# EAGLE design brmeegpwr (EAGLE 6.1)
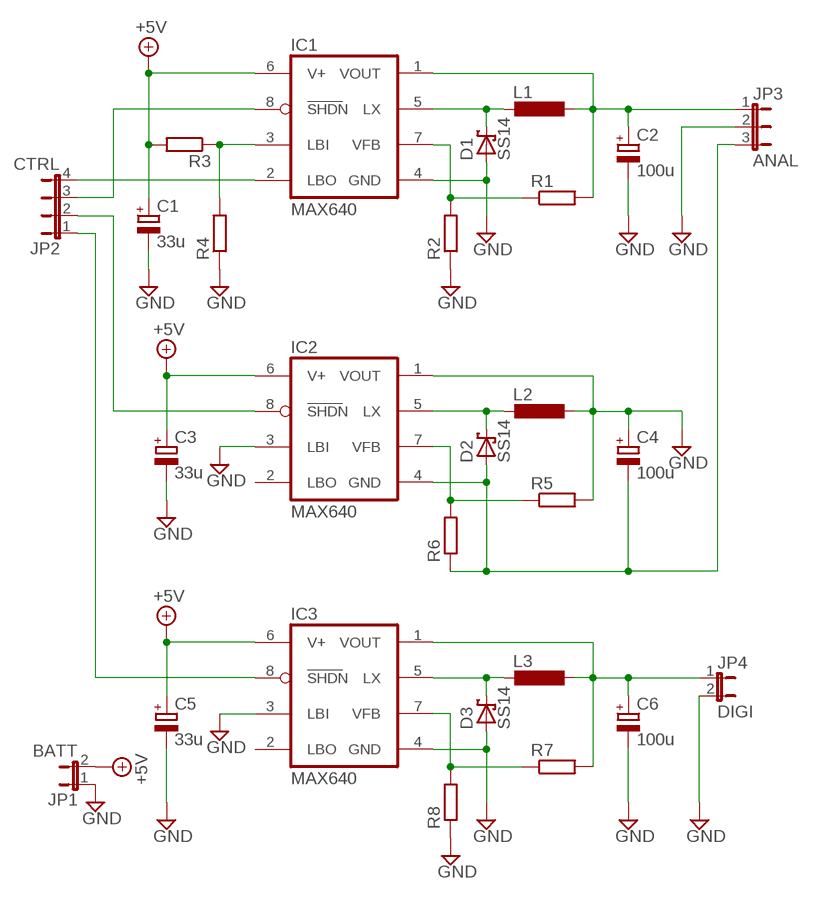
[diagram p0: schematic, sheet 1]

## Parts
C1  33u  CPOL-EUSMCC  [SMC_C]
C2  100u  CPOL-EUSMCC  [SMC_C]
C3  33u  CPOL-EUSMCC  [SMC_C]
C4  100u  CPOL-EUSMCC  [SMC_C]
C5  33u  CPOL-EUSMCC  [SMC_C]
C6  100u  CPOL-EUSMCC  [SMC_C]
D1  SS14  [SMA]
D2  SS14  [SMA]
D3  SS14  [SMA]
IC1  MAX640  [SO08]
IC2  MAX640  [SO08]
IC3  MAX640  [SO08]
JP1  BATT  JP1E  [JP1]
JP2  CTRL  JP4E  [JP4]
JP3  ANAL  JP2E  [JP2]
JP4  DIGI  JP1E  [JP1]
L1  L-EUL1812  [L1812]
L2  L-EUL1812  [L1812]
L3  L-EUL1812  [L1812]
R1  R-EU_R1206  [R1206]
R2  R-EU_R1206  [R1206]
R3  R-EU_R1206  [R1206]
R4  R-EU_R1206  [R1206]
R5  R-EU_R1206  [R1206]
R6  R-EU_R1206  [R1206]
R7  R-EU_R1206  [R1206]
R8  R-EU_R1206  [R1206]

## Nets
3V3: C6.+ IC3.1(VOUT) JP4.1 L3.1 R7.2
+2V5: C2.+ IC1.1(VOUT) JP3.1 L1.1 R1.2
+5V: C1.+ C3.+ C5.+ IC1.6(V+) IC2.6(V+) IC3.6(V+) JP1.2 R3.2
-2V5: C4.- D2.A IC2.4(GND) JP3.3 R6.1
GND: C1.- C2.- C3.- C4.+ C5.- C6.- D1.A D3.A IC1.4(GND) IC2.1(VOUT) IC2.3(LBI) IC3.3(LBI) IC3.4(GND) JP1.1 JP3.2 JP4.2 L2.1 R2.1 R4.1 R5.2 R8.1
N$1: D1.C IC1.5(LX) L1.2
N$2: IC1.8(SHDN) JP2.3
N$3: IC1.2(LBO) JP2.4
N$4: D2.C IC2.5(LX) L2.2
N$6: IC1.3(LBI) R3.1 R4.2
N$8: IC1.7(VFB) R1.1 R2.2
N$9: D3.C IC3.5(LX) L3.2
N$10: IC2.7(VFB) R5.1 R6.2
N$11: IC2.8(SHDN) JP2.2
N$13: IC3.7(VFB) R7.1 R8.2
N$14: IC3.8(SHDN) JP2.1
Unconnected: IC2.2(LBO) IC3.2(LBO)

## Library data of the parts
C1-C6 = rcl:CPOL-EU: POLARIZED CAPACITOR, European symbol
D1-D3 = mindspy:SS14
IC1-IC3 = mindspy:MAX640
JP1 JP4 = jumper:JP1E: JUMPER
JP2 = jumper:JP4E: JUMPER
JP3 = jumper:JP2E: JUMPER
L1-L3 = rcl:L-EU: INDUCTOR, European symbol
R1-R8 = rcl:R-EU_: RESISTOR, European symbol

## Board
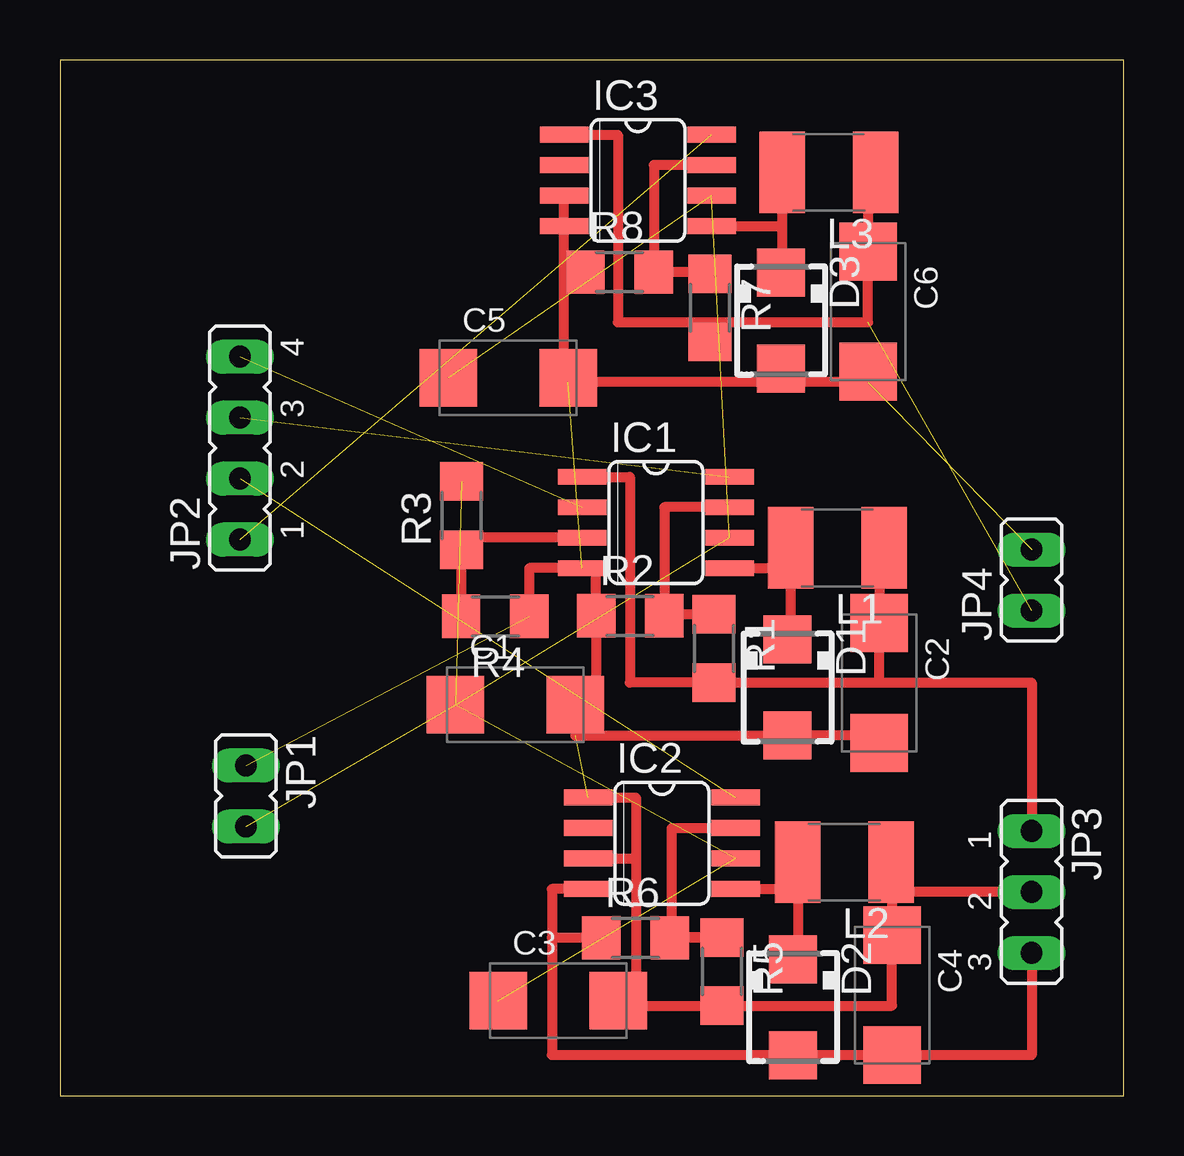
[diagram p1: board, top side]

Size 44.35 x 43.18 mm. Coordinates in mm from the lower left corner, seen from the top.
Outline: 0,0 44.35,0 44.35,43.18 0,43.18 0,0
Copper layers (1*16): Top 0.035mm / dielectric 1.5mm / Bottom 0.035mm
Design rules: minimum track width 10mil, minimum drill 24mil, track to track 8mil, track to pad 8mil, pad to pad 8mil, via to via 8mil, smd to smd 8mil, copper to edge 40mil, drill to drill 8mil, minimum pad ring 10mil, minimum via ring 8mil, stop-mask expansion 4mil, vias tented up to drill 0mil, thermal gap 10mil

### Footprints (pad centres in the part's own frame; a part is rotated, then mirrored left to right if it is on the bottom)
SMC_C = smd 2.4 x 2.4: + -2.5,0; - 2.5,0
SMA = smd 2 x 2: A 2,0; C -2,0
SO08 = smd 0.66 x 2.032: 1 -1.905,-3.073; 2 -0.635,-3.073; 3 0.635,-3.073; 4 1.905,-3.073; 5 1.905,3.073; 6 0.635,3.073; 7 -0.635,3.073; 8 -1.905,3.073
JP1 = drill 0.914 long: 1 0,-1.27; 2 0,1.27
JP4 = drill 0.914 long: 1 -3.81,0; 2 -1.27,0; 3 1.27,0; 4 3.81,0
JP2 = drill 0.914 long: 1 -2.54,0; 2 0,0; 3 2.54,0
L1812 = smd 1.9 x 3.4: 1 -1.95,0; 2 1.95,0
R1206 = smd 1.6 x 1.803: 1 -1.422,0; 2 1.422,0

### Placement (x,y rotation side)
C1  18.98,16.3 0 top
C2  34.15,17.21 270 top
C3  20.77,3.97 0 top
C4  34.68,4.2 270 top
C5  18.68,29.93 0 top
C6  33.68,32.69 270 top
D1  30.33,17.02 270 top
D2  30.56,3.7 270 top
D3  30.06,32.32 270 top
IC1  24.84,23.9 270 top
IC2  25.09,10.53 270 top
IC3  24.09,38.16 270 top
JP1  7.75,12.5 180 top
JP2  7.5,27 90 top
JP3  40.5,8.5 270 top
JP4  40.5,21.5 0 top
L1  32.41,22.84 180 top
L2  32.7,9.74 180 top
L3  32.05,38.49 180 top
R1  27.26,18.65 270 top
R2  23.77,20.01 0 top
R3  16.74,24.19 90 top
R4  18.14,19.99 180 top
R5  27.59,5.18 270 top
R6  23.99,6.59 0 top
R7  27.09,32.84 270 top
R8  23.33,34.34 0 top

### Tracks (layer width: path | path; a pad name or v marks a point on that pad's centre or on a via)
3V3  (1 unrouted)
  Top 0.406: IC3.1 23.25,40.06 23.25,32.25 27,32.25 | 27,32.25 33.68,32.25 C6.+ 33.68,38.49 L3.1 | R7.2 27,31.42 27,32.25
+2V5
  Top 0.406: IC1.1 23.75,25.8 23.75,17.23 R1.2 34.15,17.23 | 34.15,17.23 C2.+ 34.15,22.84 L1.1 | 34.15,17.23 40.5,17.23 JP3.1
+5V  (7 unrouted)
-2V5
  Top 0.406: JP3.3 40.5,1.7 C4.- | 34.68,2.14 C4.- | C4.- D2.A 20.5,1.7 20.5,6.59 | R6.1 20.5,6.59 | IC2.4 20.5,8.62 20.5,6.59
GND  (4 unrouted)
  Top 0.406: L2.1 34.68,9.74 34.68,8.5 | 34.68,8.5 C4.+ 34.68,3.76 R5.2 23.27,3.76 C3.- 24,3.97 24,9.89 | JP3.2 34.68,8.5 | IC2.1 24,12.44 24,9.89 | IC2.3 24,9.89 | C2.- 34.15,15.02 D1.A 21.48,15.02 C1.- 22.35,16.3 R2.1 22.35,22 IC1.4 19.56,22 R4.1 | IC3.3 IC3.4 21,36.26 21,33.59 | R8.1 21,33.59 | 21,33.59 21,30.93 C5.- 21.18,29.75 30,29.75 | 33.68,30.32 C6.- 33.68,29.75 30,29.75 | D3.A 30,30.32 30,29.75
N$1
  Top 0.406: IC1.5 30.46,22 | 30.46,22 L1.2 | D1.C 30.46,19.02 30.46,22
N$2  (1 unrouted)
N$3  (1 unrouted)
N$4
  Top 0.406: L2.2 30.75,8.62 | 30.75,8.62 30.75,5.7 D2.C | IC2.5 30.75,8.62
N$6
  Top 0.406: IC1.3 16.74,23.27 R3.1 16.72,22.77 R4.2
N$8
  Top 0.406: IC1.7 25.19,24.54 R2.2 25.19,20.07 R1.1
N$9
  Top 0.406: L3.2 30.1,36.25 | 30.1,36.25 30.1,34.32 D3.C | IC3.5 30.1,36.25
N$10
  Top 0.406: R6.2 25.41,6.6 R5.1 25.5,6.6 25.5,11.16 IC2.7
N$11  (1 unrouted)
N$13
  Top 0.406: R7.1 27.09,34.34 R8.2 24.75,38.8 IC3.7
N$14  (1 unrouted)